# Altium project RP2040Breakout.PrjPcb (part 1 of 2)
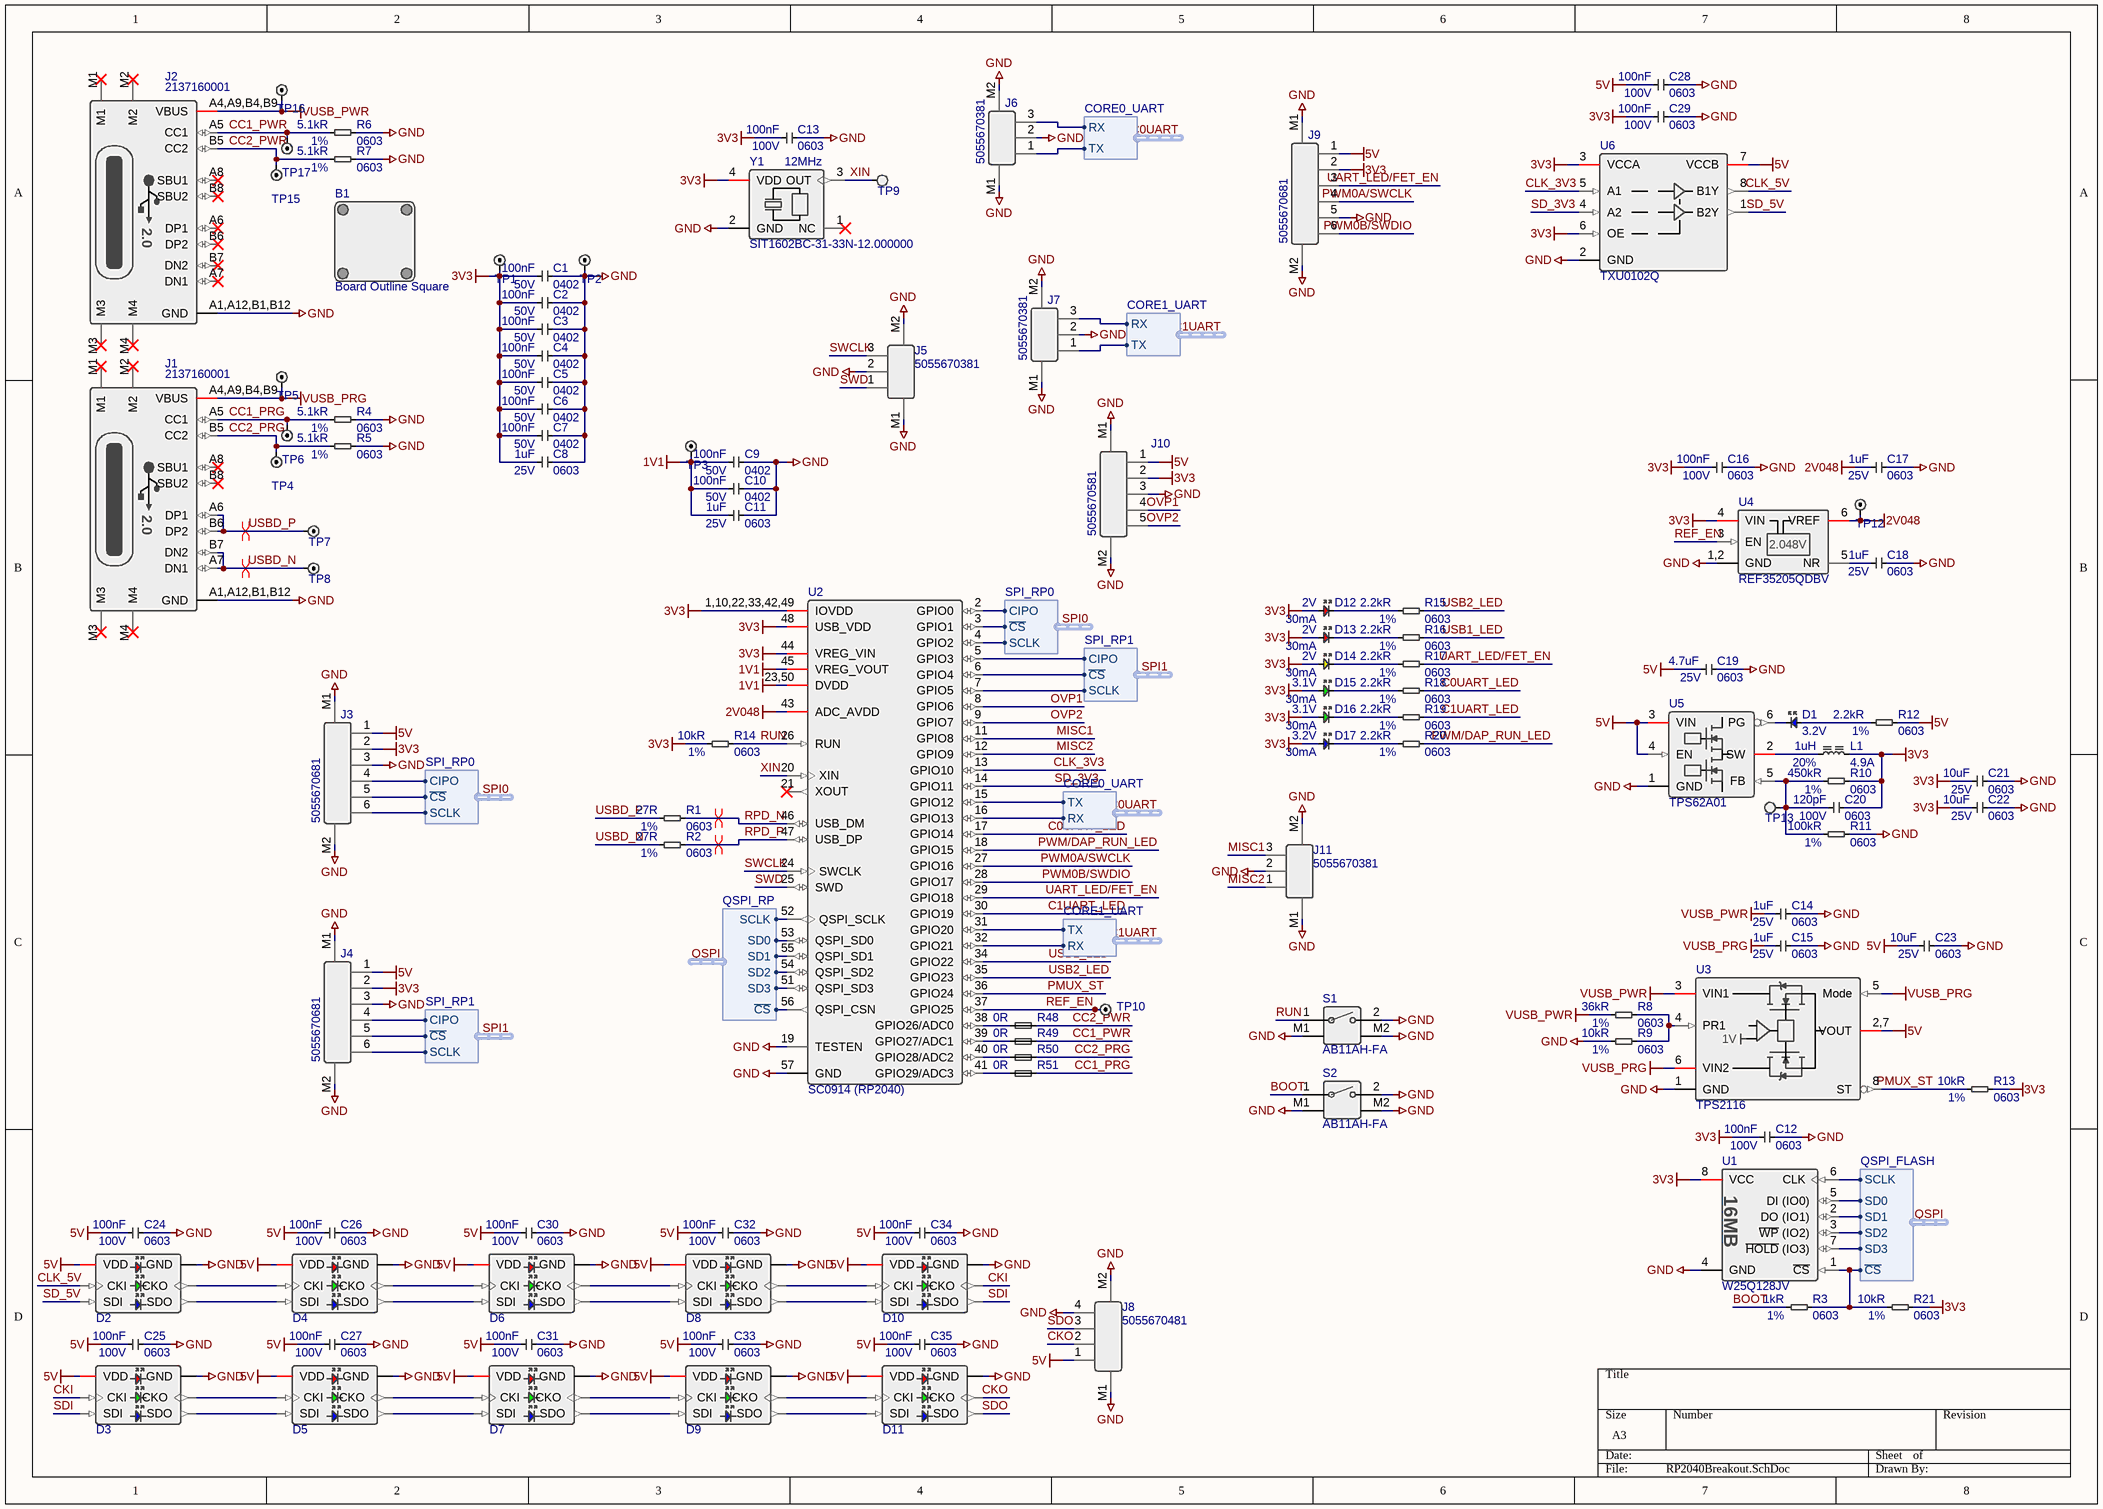
[diagram p0: RP2040Breakout.SchDoc]
2 sheets, 125 parts. Net scope: global (net labels, ports and power ports of the same name join across sheets).
Board file: RP2040Breakout.PcbDoc
Sheets:
  RP2040Breakout.SchDoc
  USBPowerMux.SchDoc

## Sheet RP2040Breakout.SchDoc
size A3; SheetNumber: 1; SheetTotal: 2

### Parts
(Parts that share a designator on the sheet are numbered #1, #2 ... from top to bottom, then left to right.)
B1  Board Outline Square  [PCB_OUTLINE_SQUARE]
C1#1  value 100nF  Voltage - Rated: 50V  Package/Case Imperial: 0402  [CAPACITOR_0402(1005)_GENERIC]  (hidden comment: Capacitor - Ceramic - Generic)
C2#1  value 100nF  Voltage - Rated: 50V  Package/Case Imperial: 0402  [CAPACITOR_0402(1005)_GENERIC]  (hidden comment: Capacitor - Ceramic - Generic)
C3#1  value 100nF  Voltage - Rated: 50V  Package/Case Imperial: 0402  [CAPACITOR_0402(1005)_GENERIC]  (hidden comment: Capacitor - Ceramic - Generic)
C4  value 100nF  Voltage - Rated: 50V  Package/Case Imperial: 0402  [CAPACITOR_0402(1005)_GENERIC]  (hidden comment: Capacitor - Ceramic - Generic)
C5  value 100nF  Voltage - Rated: 50V  Package/Case Imperial: 0402  [CAPACITOR_0402(1005)_GENERIC]  (hidden comment: Capacitor - Ceramic - Generic)
C6  value 100nF  Voltage - Rated: 50V  Package/Case Imperial: 0402  [CAPACITOR_0402(1005)_GENERIC]  (hidden comment: Capacitor - Ceramic - Generic)
C7  value 100nF  Voltage - Rated: 50V  Package/Case Imperial: 0402  [CAPACITOR_0402(1005)_GENERIC]  (hidden comment: Capacitor - Ceramic - Generic)
C8  value 1uF  Voltage - Rated: 25V  Package/Case Imperial: 0603  [CAPACITOR_0603(1608)_GENERIC]  (hidden comment: Capacitor - Ceramic - Generic)
C9  value 100nF  Voltage - Rated: 50V  Package/Case Imperial: 0402  [CAPACITOR_0402(1005)_GENERIC]  (hidden comment: Capacitor - Ceramic - Generic)
C10  value 100nF  Voltage - Rated: 50V  Package/Case Imperial: 0402  [CAPACITOR_0402(1005)_GENERIC]  (hidden comment: Capacitor - Ceramic - Generic)
C11  value 1uF  Voltage - Rated: 25V  Package/Case Imperial: 0603  [CAPACITOR_0603(1608)_GENERIC]  (hidden comment: Capacitor - Ceramic - Generic)
C12  value 100nF  Voltage - Rated: 100V  Package/Case Imperial: 0603  [CAPACITOR_0603(1608)_GENERIC]  (hidden comment: Capacitor - Ceramic - Generic)
C13  value 100nF  Voltage - Rated: 100V  Package/Case Imperial: 0603  [CAPACITOR_0603(1608)_GENERIC]  (hidden comment: Capacitor - Ceramic - Generic)
C14  value 1uF  Voltage - Rated: 25V  Package/Case Imperial: 0603  [CAPACITOR_0603(1608)_GENERIC]  (hidden comment: Capacitor - Ceramic - Generic)
C15  value 1uF  Voltage - Rated: 25V  Package/Case Imperial: 0603  [CAPACITOR_0603(1608)_GENERIC]  (hidden comment: Capacitor - Ceramic - Generic)
C16  value 100nF  Voltage - Rated: 100V  Package/Case Imperial: 0603  [CAPACITOR_0603(1608)_GENERIC]  (hidden comment: Capacitor - Ceramic - Generic)
C17  value 1uF  Voltage - Rated: 25V  Package/Case Imperial: 0603  [CAPACITOR_0603(1608)_GENERIC]  (hidden comment: Capacitor - Ceramic - Generic)
C18  value 1uF  Voltage - Rated: 25V  Package/Case Imperial: 0603  [CAPACITOR_0603(1608)_GENERIC]  (hidden comment: Capacitor - Ceramic - Generic)
C19  value 4.7uF  Voltage - Rated: 25V  Package/Case Imperial: 0603  [CAPACITOR_0603(1608)_GENERIC]  (hidden comment: Capacitor - Ceramic - Generic)
C20  value 120pF  Voltage - Rated: 100V  Package/Case Imperial: 0603  [CAPACITOR_0603(1608)_GENERIC]  (hidden comment: Capacitor - Ceramic - Generic)
C21  value 10uF  Voltage - Rated: 25V  Package/Case Imperial: 0603  [CAPACITOR_0603(1608)_GENERIC]  (hidden comment: Capacitor - Ceramic - Generic)
C22  value 10uF  Voltage - Rated: 25V  Package/Case Imperial: 0603  [CAPACITOR_0603(1608)_GENERIC]  (hidden comment: Capacitor - Ceramic - Generic)
C23  value 10uF  Voltage - Rated: 25V  Package/Case Imperial: 0603  [CAPACITOR_0603(1608)_GENERIC]  (hidden comment: Capacitor - Ceramic - Generic)
C24  value 100nF  Voltage - Rated: 100V  Package/Case Imperial: 0603  [CAPACITOR_0603(1608)_GENERIC]  (hidden comment: Capacitor - Ceramic - Generic)
C25  value 100nF  Voltage - Rated: 100V  Package/Case Imperial: 0603  [CAPACITOR_0603(1608)_GENERIC]  (hidden comment: Capacitor - Ceramic - Generic)
C26  value 100nF  Voltage - Rated: 100V  Package/Case Imperial: 0603  [CAPACITOR_0603(1608)_GENERIC]  (hidden comment: Capacitor - Ceramic - Generic)
C27  value 100nF  Voltage - Rated: 100V  Package/Case Imperial: 0603  [CAPACITOR_0603(1608)_GENERIC]  (hidden comment: Capacitor - Ceramic - Generic)
C28  value 100nF  Voltage - Rated: 100V  Package/Case Imperial: 0603  [CAPACITOR_0603(1608)_GENERIC]  (hidden comment: Capacitor - Ceramic - Generic)
C29  value 100nF  Voltage - Rated: 100V  Package/Case Imperial: 0603  [CAPACITOR_0603(1608)_GENERIC]  (hidden comment: Capacitor - Ceramic - Generic)
C30  value 100nF  Voltage - Rated: 100V  Package/Case Imperial: 0603  [CAPACITOR_0603(1608)_GENERIC]  (hidden comment: Capacitor - Ceramic - Generic)
C31  value 100nF  Voltage - Rated: 100V  Package/Case Imperial: 0603  [CAPACITOR_0603(1608)_GENERIC]  (hidden comment: Capacitor - Ceramic - Generic)
C32  value 100nF  Voltage - Rated: 100V  Package/Case Imperial: 0603  [CAPACITOR_0603(1608)_GENERIC]  (hidden comment: Capacitor - Ceramic - Generic)
C33  value 100nF  Voltage - Rated: 100V  Package/Case Imperial: 0603  [CAPACITOR_0603(1608)_GENERIC]  (hidden comment: Capacitor - Ceramic - Generic)
C34  value 100nF  Voltage - Rated: 100V  Package/Case Imperial: 0603  [CAPACITOR_0603(1608)_GENERIC]  (hidden comment: Capacitor - Ceramic - Generic)
C35  value 100nF  Voltage - Rated: 100V  Package/Case Imperial: 0603  [CAPACITOR_0603(1608)_GENERIC]  (hidden comment: Capacitor - Ceramic - Generic)
D1  Forward Voltage: 3.2V  [WL-SMSW_3014_WURTH]  (hidden comment: 155301BS73100)
D2  APA102C  [5X5MM(6PIN)_JLEAD_GENERIC]  (value not drawn)
D3  APA102C  [5X5MM(6PIN)_JLEAD_GENERIC]  (value not drawn)
D4  APA102C  [5X5MM(6PIN)_JLEAD_GENERIC]  (value not drawn)
D5  APA102C  [5X5MM(6PIN)_JLEAD_GENERIC]  (value not drawn)
D6  APA102C  [5X5MM(6PIN)_JLEAD_GENERIC]  (value not drawn)
D7  APA102C  [5X5MM(6PIN)_JLEAD_GENERIC]  (value not drawn)
D8  APA102C  [5X5MM(6PIN)_JLEAD_GENERIC]  (value not drawn)
D9  APA102C  [5X5MM(6PIN)_JLEAD_GENERIC]  (value not drawn)
D10  APA102C  [5X5MM(6PIN)_JLEAD_GENERIC]  (value not drawn)
D11  APA102C  [5X5MM(6PIN)_JLEAD_GENERIC]  (value not drawn)
D12  Current - Max: 30mA  Forward Voltage: 2V  [WL-SMSW_3014_WURTH]  (hidden comment: 155301RS73100)
D13  Current - Max: 30mA  Forward Voltage: 2V  [WL-SMSW_3014_WURTH]  (hidden comment: 155301RS73100)
D14  Current - Max: 30mA  Forward Voltage: 2V  [WL-SMSW_3014_WURTH]  (hidden comment: 155301YS73100)
D15  Current - Max: 30mA  Forward Voltage: 3.1V  [WL-SMSW_3014_WURTH]  (hidden comment: 155301GS73100)
D16  Current - Max: 30mA  Forward Voltage: 3.1V  [WL-SMSW_3014_WURTH]  (hidden comment: 155301GS73100)
D17  Current - Max: 30mA  Forward Voltage: 3.2V  [WL-SMSW_3014_WURTH]  (hidden comment: 155301BS73100)
J1  2137160001  [CONN_PORT_USB-C_MOLEX-2137160001]
J2  2137160001  [CONN_PORT_USB-C_MOLEX-2137160001]
J3  Manufacturer Part Number 1: 5055670681  [CONNECTOR_HEADER_MOLEX_5055670681]  (hidden comment: Connector - Header - 6P 2M - Generic)
J4  Manufacturer Part Number 1: 5055670681  [CONNECTOR_HEADER_MOLEX_5055670681]  (hidden comment: Connector - Header - 6P 2M - Generic)
J5  Manufacturer Part Number 1: 5055670381  [CONNECTOR_HEADER_MOLEX_5055670381]  (hidden comment: Connector - Header - 3P 2M - Generic)
J6  Manufacturer Part Number 1: 5055670381  [CONNECTOR_HEADER_MOLEX_5055670381]  (hidden comment: Connector - Header - 3P 2M - Generic)
J7  Manufacturer Part Number 1: 5055670381  [CONNECTOR_HEADER_MOLEX_5055670381]  (hidden comment: Connector - Header - 3P 2M - Generic)
J8  Manufacturer Part Number 1: 5055670481  [CONNECTOR_HEADER_MOLEX_5055670481]  (hidden comment: Connector - Header - 4P 2M - Generic)
J9  Manufacturer Part Number 1: 5055670681  [CONNECTOR_HEADER_MOLEX_5055670681]  (hidden comment: Connector - Header - 6P 2M - Generic)
J10  Manufacturer Part Number 1: 5055670581  [CONNECTOR_HEADER_MOLEX_5055670581]  (hidden comment: Connector - Header - 5P 2M - Generic)
J11  Manufacturer Part Number 1: 5055670381  [CONNECTOR_HEADER_MOLEX_5055670381]  (hidden comment: Connector - Header - 3P 2M - Generic)
L1  value 1uH  Tolerance: 20%  Current - Rating: 4.9A  [XGL3512_COILCRAFT]  (hidden comment: Inductor - Ferrite Core - Generic)
R1#1  value 27R  Tolerance: 1%  Package/Case Imperial: 0603  [RESISTOR_0603(1608)_GENERIC]  (hidden comment: Resistor - Fixed - Generic)
R2#1  value 27R  Tolerance: 1%  Package/Case Imperial: 0603  [RESISTOR_0603(1608)_GENERIC]  (hidden comment: Resistor - Fixed - Generic)
R3#1  value 1kR  Tolerance: 1%  Package/Case Imperial: 0603  [RESISTOR_0603(1608)_GENERIC]  (hidden comment: Resistor - Fixed - Generic)
R4#1  value 5.1kR  Tolerance: 1%  Package/Case Imperial: 0603  [RESISTOR_0603(1608)_GENERIC]  (hidden comment: Resistor - Fixed - Generic)
R5  value 5.1kR  Tolerance: 1%  Package/Case Imperial: 0603  [RESISTOR_0603(1608)_GENERIC]  (hidden comment: Resistor - Fixed - Generic)
R6  value 5.1kR  Tolerance: 1%  Package/Case Imperial: 0603  [RESISTOR_0603(1608)_GENERIC]  (hidden comment: Resistor - Fixed - Generic)
R7  value 5.1kR  Tolerance: 1%  Package/Case Imperial: 0603  [RESISTOR_0603(1608)_GENERIC]  (hidden comment: Resistor - Fixed - Generic)
R8  value 36kR  Tolerance: 1%  Package/Case Imperial: 0603  [RESISTOR_0603(1608)_GENERIC]  (hidden comment: Resistor - Fixed - Generic)
R9  value 10kR  Tolerance: 1%  Package/Case Imperial: 0603  [RESISTOR_0603(1608)_GENERIC]  (hidden comment: Resistor - Fixed - Generic)
R10  value 450kR  Tolerance: 1%  Package/Case Imperial: 0603  [RESISTOR_0603(1608)_GENERIC]  (hidden comment: Resistor - Fixed - Generic)
R11  value 100kR  Tolerance: 1%  Package/Case Imperial: 0603  [RESISTOR_0603(1608)_GENERIC]  (hidden comment: Resistor - Fixed - Generic)
R12  value 2.2kR  Tolerance: 1%  Package/Case Imperial: 0603  [RESISTOR_0603(1608)_GENERIC]  (hidden comment: Resistor - Fixed - Generic)
R13  value 10kR  Tolerance: 1%  Package/Case Imperial: 0603  [RESISTOR_0603(1608)_GENERIC]  (hidden comment: Resistor - Fixed - Generic)
R14  value 10kR  Tolerance: 1%  Package/Case Imperial: 0603  [RESISTOR_0603(1608)_GENERIC]  (hidden comment: Resistor - Fixed - Generic)
R15  value 2.2kR  Tolerance: 1%  Package/Case Imperial: 0603  [RESISTOR_0603(1608)_GENERIC]  (hidden comment: Resistor - Fixed - Generic)
R16  value 2.2kR  Tolerance: 1%  Package/Case Imperial: 0603  [RESISTOR_0603(1608)_GENERIC]  (hidden comment: Resistor - Fixed - Generic)
R17  value 2.2kR  Tolerance: 1%  Package/Case Imperial: 0603  [RESISTOR_0603(1608)_GENERIC]  (hidden comment: Resistor - Fixed - Generic)
R18  value 2.2kR  Tolerance: 1%  Package/Case Imperial: 0603  [RESISTOR_0603(1608)_GENERIC]  (hidden comment: Resistor - Fixed - Generic)
R19  value 2.2kR  Tolerance: 1%  Package/Case Imperial: 0603  [RESISTOR_0603(1608)_GENERIC]  (hidden comment: Resistor - Fixed - Generic)
R20  value 2.2kR  Tolerance: 1%  Package/Case Imperial: 0603  [RESISTOR_0603(1608)_GENERIC]  (hidden comment: Resistor - Fixed - Generic)
R21  value 10kR  Tolerance: 1%  Package/Case Imperial: 0603  [RESISTOR_0603(1608)_GENERIC]  (hidden comment: Resistor - Fixed - Generic)
R48  value 0R  [RESISTOR_0603(1608)_NC_JUMPER]  (hidden comment: Resistor - Fixed - Jumper)  (net tie, no BOM)
R49  value 0R  [RESISTOR_0603(1608)_NC_JUMPER]  (hidden comment: Resistor - Fixed - Jumper)  (net tie, no BOM)
R50  value 0R  [RESISTOR_0603(1608)_NC_JUMPER]  (hidden comment: Resistor - Fixed - Jumper)  (net tie, no BOM)
R51  value 0R  [RESISTOR_0603(1608)_NC_JUMPER]  (hidden comment: Resistor - Fixed - Jumper)  (net tie, no BOM)
S1  AB11AH-FA  [SWITCH_PUSHBUTTON_NKK_AB11AH-FA]
S2  AB11AH-FA  [SWITCH_PUSHBUTTON_NKK_AB11AH-FA]
TP1  Test Point - THT  [TESTPOINT_THT_OCTAGON]  (value not drawn)
TP2  Test Point - THT  [TESTPOINT_THT_OCTAGON]  (value not drawn)
TP3  Test Point - THT  [TESTPOINT_THT_OCTAGON]  (value not drawn)
TP4  Test Point - THT  [TESTPOINT_THT_OCTAGON]  (value not drawn)
TP5  Test Point - THT  [TESTPOINT_THT_OCTAGON]  (value not drawn)
TP6  Test Point - THT  [TESTPOINT_THT_OCTAGON]  (value not drawn)
TP7  Test Point - THT  [TESTPOINT_THT_OCTAGON]  (value not drawn)
TP8  Test Point - THT  [TESTPOINT_THT_OCTAGON]  (value not drawn)
TP9  Test Point - SMT  [TESTPOINT_SMT_OCTAGON]  (value not drawn)
TP10  Test Point - THT  [TESTPOINT_THT_OCTAGON]  (value not drawn)
TP12  Test Point - THT  [TESTPOINT_THT_OCTAGON]  (value not drawn)
TP13  Test Point - SMT  [TESTPOINT_SMT_OCTAGON]  (value not drawn)
TP15  Test Point - THT  [TESTPOINT_THT_OCTAGON]  (value not drawn)
TP16  Test Point - THT  [TESTPOINT_THT_OCTAGON]  (value not drawn)
TP17  Test Point - THT  [TESTPOINT_THT_OCTAGON]  (value not drawn)
U1#1  W25Q128JV  [WSON-8(6x5mm)_WINBOND]
U2  SC0914 (RP2040)  [QFN-56(7x7)_RASPBERRYPI]
U3  TPS2116  [SOT-583(DRL0008A)_TI]
U4  REF35205QDBV  [SOT23-6(DBV0006A)_TI]
U5  TPS62A01  [SOT-563(DRL0006A)_TI]
U6  TXU0102Q  [VSSOP-8(DCU0008A)_TI]
Y1  SIT1602BC-31-33N-12.000000  Frequency: 12MHz  [4-SMD(4-QFN)_SiTime]

### Harnesses
QSPI_RP: SCLK, SD0, SD1, SD2, SD3, ~{CS}
QSPI_FLASH: SCLK, ~{CS}, SD0, SD1, SD2, SD3
CORE0_UART: TX, RX
CORE1_UART: TX, RX
SPI_RP0: SCLK, CIPO, ~{CS}
SPI_RP1: SCLK, CIPO, ~{CS}

### Nets
1V1: C9.2 C10.2 C11.2 TP3.1 U2.23,50(DVDD) U2.45(VREG_VOUT)
2V048: C17.2 TP12.1 U2.43(ADC_AVDD) U4.6(VREF)
3V3: C1#1.2 C2#1.2 C3#1.2 C4.2 C5.2 C6.2 C7.2 C8.2 C12.1 C13.1 C16.1 C20.2 C21.2 C22.2 C29.1 D12.2(A) D13.2(A) D14.2(A) D15.2(A) D16.2(A) D17.2(A) J3.2 J4.2 J9.2 J10.2 L1.2 R10.1 R13.2 R14.1 R21.2 TP1.1 U1#1.8(VCC) U2.1,10,22,33,42,49(IOVDD) U2.44(VREG_VIN) U2.48(USB_VDD) U4.4(VIN) U6.3(VCCA) U6.6(OE) Y1.4(VDD)
5V: C19.1 C23.2 C24.1 C25.1 C26.1 C27.1 C28.1 C30.1 C31.1 C32.1 C33.1 C34.1 C35.1 D2.4(VDD) D3.4(VDD) D4.4(VDD) D5.4(VDD) D6.4(VDD) D7.4(VDD) D8.4(VDD) D9.4(VDD) D10.4(VDD) D11.4(VDD) J3.1 J4.1 J8.1 J9.1 J10.1 R12.2 U3.2,7(VOUT) U5.3(VIN) U5.4(EN) U6.7(VCCB)
GND: C1#1.1 C2#1.1 C3#1.1 C4.1 C5.1 C6.1 C7.1 C8.1 C9.1 C10.1 C11.1 C12.2 C13.2 C14.1 C15.1 C16.2 C17.1 C18.1 C19.2 C21.1 C22.1 C23.1 C24.2 C25.2 C26.2 C27.2 C28.2 C29.2 C30.2 C31.2 C32.2 C33.2 C34.2 C35.2 D2.3(GND) D3.3(GND) D4.3(GND) D5.3(GND) D6.3(GND) D7.3(GND) D8.3(GND) D9.3(GND) D10.3(GND) D11.3(GND) J1.A1,A12,B1,B12(GND) J2.A1,A12,B1,B12(GND) J3.3 J3.M1 J3.M2 J4.3 J4.M1 J4.M2 J5.2 J5.M1 J5.M2 J6.2 J6.M1 J6.M2 J7.2 J7.M1 J7.M2 J8.4 J8.M1 J8.M2 J9.5 J9.M1 J9.M2 J10.3 J10.M1 J10.M2 J11.2 J11.M1 J11.M2 R4#1.2 R5.2 R6.2 R7.2 R9.1 R11.2 S1.2 S1.M1 S1.M2 S2.2 S2.M1 S2.M2 TP2.1 U1#1.4(GND) U2.19(TESTEN) U2.57(GND) U3.1(GND) U4.1,2(GND) U5.1(GND) U6.2(GND) Y1.2(GND)
VUSB_PRG: C15.2 J1.A4,A9,B4,B9(VBUS) TP5.1 U3.5(Mode) U3.6(VIN2)
VUSB_PWR: C14.2 J2.A4,A9,B4,B9(VBUS) R8.1 TP16.1 U3.3(VIN1)
BOOT: R3#1.1 S2.1
C0UART.RX: J6.3 U2.16(GPIO13) ; harness CORE0_UART.RX
C0UART.TX: J6.1 U2.15(GPIO12) ; harness CORE0_UART.TX
C0UART_LED: R18.2 U2.17(GPIO14)
C1UART.RX: J7.3 U2.32(GPIO21) ; harness CORE1_UART.RX
C1UART.TX: J7.1 U2.31(GPIO20) ; harness CORE1_UART.TX
C1UART_LED: R19.2 U2.30(GPIO19)
CC1_PRG: J1.A5(CC1) R4#1.1 R51.2 TP6.1
CC1_PWR: J2.A5(CC1) R6.1 R49.2 TP17.1
CC2_PRG: J1.B5(CC2) R5.1 R50.2 TP4.1
CC2_PWR: J2.B5(CC2) R7.1 R48.2 TP15.1
CKI: D3.2(CKI) D10.5(CKO)
CKO: D11.5(CKO) J8.2
CLK_3V3: U2.13(GPIO10) U6.5(A1)
CLK_5V: D2.2(CKI) U6.8(B1Y)
MISC1: J11.3 U2.11(GPIO8)
MISC2: J11.1 U2.12(GPIO9)
OVP1: J10.4 U2.8(GPIO6)
OVP2: J10.5 U2.9(GPIO7)
PMUX_ST: R13.1 U2.36(GPIO24) U3.8(ST)
PWM0A/SWCLK: J9.4 U2.27(GPIO16)
PWM0B/SWDIO: J9.6 U2.28(GPIO17)
PWM/DAP_RUN_LED: R20.2 U2.18(GPIO15)
QSPI.~{CS}: R3#1.2 R21.1 U1#1.1(~{CS}) U2.56(QSPI_CSN) ; harness QSPI_RP.~{CS}, harness QSPI_FLASH.~{CS}
QSPI.SCLK: U1#1.6(CLK) U2.52(QSPI_SCLK) ; harness QSPI_RP.SCLK, harness QSPI_FLASH.SCLK
QSPI.SD0: U1#1.5(DI_(IO0)) U2.53(QSPI_SD0) ; harness QSPI_RP.SD0, harness QSPI_FLASH.SD0
QSPI.SD1: U1#1.2(DO_(IO1)) U2.55(QSPI_SD1) ; harness QSPI_RP.SD1, harness QSPI_FLASH.SD1
QSPI.SD2: U1#1.3(~{WP}_(IO2)) U2.54(QSPI_SD2) ; harness QSPI_RP.SD2, harness QSPI_FLASH.SD2
QSPI.SD3: U1#1.7(~{HOLD}_(IO3)) U2.51(QSPI_SD3) ; harness QSPI_RP.SD3, harness QSPI_FLASH.SD3
REF_EN: TP10.1 U2.37(GPIO25) U4.3(EN)
RPD_N: R1#1.2 U2.46(USB_DM)
RPD_P: R2#1.2 U2.47(USB_DP)
RUN: R14.2 S1.1 U2.26(RUN)
SD_3V3: U2.14(GPIO11) U6.4(A2)
SD_5V: D2.1(SDI) U6.1(B2Y)
SDI: D3.1(SDI) D10.6(SDO)
SDO: D11.6(SDO) J8.3
SPI0.~{CS}: J3.5 U2.3(GPIO1) ; harness SPI_RP0.~{CS}
SPI0.CIPO: J3.4 U2.2(GPIO0) ; harness SPI_RP0.CIPO
SPI0.SCLK: J3.6 U2.4(GPIO2) ; harness SPI_RP0.SCLK
SPI1.~{CS}: J4.5 U2.6(GPIO4) ; harness SPI_RP1.~{CS}
SPI1.CIPO: J4.4 U2.5(GPIO3) ; harness SPI_RP1.CIPO
SPI1.SCLK: J4.6 U2.7(GPIO5) ; harness SPI_RP1.SCLK
SWCLK: J5.3 U2.24(SWCLK)
SWD: J5.1 U2.25(SWD)
UART_LED/FET_EN: J9.3 R17.2 U2.29(GPIO18)
USB1_LED: R16.2 U2.34(GPIO22)
USB2_LED: R15.2 U2.35(GPIO23)
USBD_N: J1.A7(DN1) J1.B7(DN2) R2#1.1 TP8.1
USBD_P: J1.A6(DP1) J1.B6(DP2) R1#1.1 TP7.1
XIN: TP9.1 U2.20(XIN) Y1.3(OUT)
NetC18_2: C18.2 U4.5(NR)
NetC20_1: C20.1 R10.2 R11.1 TP13.1 U5.5(FB)
NetD1_1: D1.1(C) U5.6(PG)
NetD1_2: D1.2(A) R12.1
NetD2_5: D2.5(CKO) D4.2(CKI)
NetD2_6: D2.6(SDO) D4.1(SDI)
NetD3_5: D3.5(CKO) D5.2(CKI)
NetD3_6: D3.6(SDO) D5.1(SDI)
NetD4_5: D4.5(CKO) D6.2(CKI)
NetD4_6: D4.6(SDO) D6.1(SDI)
NetD5_5: D5.5(CKO) D7.2(CKI)
NetD5_6: D5.6(SDO) D7.1(SDI)
NetD6_5: D6.5(CKO) D8.2(CKI)
NetD6_6: D6.6(SDO) D8.1(SDI)
NetD7_5: D7.5(CKO) D9.2(CKI)
NetD7_6: D7.6(SDO) D9.1(SDI)
NetD8_5: D8.5(CKO) D10.2(CKI)
NetD8_6: D8.6(SDO) D10.1(SDI)
NetD9_5: D9.5(CKO) D11.2(CKI)
NetD9_6: D9.6(SDO) D11.1(SDI)
NetD12_1: D12.1(C) R15.1
NetD13_1: D13.1(C) R16.1
NetD14_1: D14.1(C) R17.1
NetD15_1: D15.1(C) R18.1
NetD16_1: D16.1(C) R19.1
NetD17_1: D17.1(C) R20.1
NetL1_1: L1.1 U5.2(SW)
NetR8_2: R8.2 R9.2 U3.4(PR1)
NetR48_1: R48.1 U2.38(GPIO26/ADC0)
NetR49_1: R49.1 U2.39(GPIO27/ADC1)
NetR50_1: R50.1 U2.40(GPIO28/ADC2)
NetR51_1: R51.1 U2.41(GPIO29/ADC3)

Not connected (* = marked no-connect by the designer): J1 A8(SBU1)* B8(SBU2)* M1* M2* M3* M4*; J2 A6(DP1)* A7(DN1)* A8(SBU1)* B6(DP2)* B7(DN2)* B8(SBU2)* M1* M2* M3* M4*; U2 21(XOUT)*; Y1 1(NC)*

### Layout directives
differential pair: RPD_N, RPD_P, USBD_N, USBD_P

### Notes on the sheet
- (in symbol Connector - Ports - USB C - Molex 2137160001) 2.0
- (in symbol IC - Memory - Non-Volatile - WinBond W25Q128JV) 16MB
- (in symbol IC - Power Management - Mux - TI TPS2116) 1V
- (in symbol IC - Power Management - Voltage Reference - TI REF35205) 2.048V

### Library data of the parts
B1 = Board_Outline_Square
C1#1 C2#1 C3#1 C4-C7 C9 C10 = CAP-CER_100NF_50V_10%_X7R_0402(1005): 100nF ±10% 50V Ceramic Capacitor X7R 0402(1005 Metric); Manufacturer 1: Murata Electronics; Manufacturer Part Number 1: GRM155R71H104KE14J; Manufacturer Lifecycle 1: Active; Package/Case Metric: 1005; Name: CAP-CER_100NF_50V_10%_X7R_0402(1005); Item: CAP-CER; Temperature Coefficient: X7R; Tolerance: 10%; Mounting Type: SMT; Full Item: Ceramic Capacitor; Manufacturer 2: Murata Electronics; Manufacturer Part Number 2: GRM155C71H104KE19D; Manufacturer Lifecycle 2: Active; Manufacturer 3: Murata Electronics; Manufacturer Part Number 3: GRM155R71H104KE14D; Manufacturer Lifecycle 3: Active
C8 C11 C14 C15 C17 C18 = CAP-CER_1UF_25V_20%_X7R_0603(1608): 1uF ±20% 25V Ceramic Capacitor X7R 0603(1608 Metric); Manufacturer 1: Murata Electronics; Manufacturer Part Number 1: GCM188R71E105KA64D; Manufacturer Lifecycle 1: Active; Package/Case Metric: 1608; Name: CAP-CER_1UF_25V_20%_X7R_0603(1608); Item: CAP-CER; Temperature Coefficient: X7R; Tolerance: 20%; Mounting Type: SMT; Full Item: Ceramic Capacitor; Manufacturer 2: Murata Electronics; Manufacturer Part Number 2: GCM188R71E105KA64J; Manufacturer Lifecycle 2: Active; Manufacturer 3: Murata Electronics; Manufacturer Part Number 3: GCM188R71E105MA64D; Manufacturer Lifecycle 3: Active
C12 C13 C16 C24-C35 = CAP-CER_100NF_100V_20%_X7R_0603(1608): 100nF ±20% 100V Ceramic Capacitor X7R 0603(1608 Metric); Manufacturer 1: Murata Electronics; Manufacturer Part Number 1: GRM188R72A104KA35D; Manufacturer Lifecycle 1: Active; Package/Case Metric: 1608; Name: CAP-CER_100NF_100V_20%_X7R_0603(1608); Item: CAP-CER; Temperature Coefficient: X7R; Tolerance: 20%; Mounting Type: SMT; Full Item: Ceramic Capacitor; Manufacturer 2: Murata Electronics; Manufacturer Part Number 2: GRM188R72A104KA35J; Manufacturer Lifecycle 2: Active; Manufacturer 3: Murata Electronics; Manufacturer Part Number 3: GRM188R72A104MA35D; Manufacturer Lifecycle 3: Active
C19 = CAP-CER_4.7UF_25V_20%_X6S_0603(1608): 4.7uF ±20% 25V Ceramic Capacitor X6S 0603(1608 Metric); Manufacturer 1: Murata Electronics; Manufacturer Part Number 1: GRM188C81E475KE11D; Manufacturer Lifecycle 1: Active; Package/Case Metric: 1608; Name: CAP-CER_4.7UF_25V_20%_X6S_0603(1608); Item: CAP-CER; Temperature Coefficient: X6S; Tolerance: 20%; Mounting Type: SMT; Full Item: Ceramic Capacitor; Manufacturer 2: Murata Electronics; Manufacturer Part Number 2: GRM188C81E475ME11D; Manufacturer Lifecycle 2: Active; Manufacturer 3: Murata Electronics; Manufacturer Part Number 3: GRM188C81E475KE11J; Manufacturer Lifecycle 3: Active
C20 = CAP-CER_120PF_100V_5%_C0G/NP0_0603(1608): 120pF ±5% 100V Ceramic Capacitor C0G/NP0 0603(1608 Metric); Manufacturer 1: Murata Electronics; Manufacturer Part Number 1: GCM1885C2A121FA16D; Manufacturer Lifecycle 1: Active; Package/Case Metric: 1608; Name: CAP-CER_120PF_100V_5%_C0G/NP0_0603(1608); Item: CAP-CER; Temperature Coefficient: C0G/NP0; Tolerance: 5%; Mounting Type: SMT; Full Item: Ceramic Capacitor; Manufacturer 2: Murata Electronics; Manufacturer Part Number 2: GCM1885C2A121JA16D; Manufacturer Lifecycle 2: Active; Manufacturer 3: Murata Electronics; Manufacturer Part Number 3: GCM1885C2A121FA16J; Manufacturer Lifecycle 3: Active
C21-C23 = CAP-CER_10UF_25V_20%_X5R_0603(1608): 10uF ±20% 25V Ceramic Capacitor X5R 0603(1608 Metric); Manufacturer 1: Murata Electronics; Manufacturer Part Number 1: GRM188R61E106KA73J; Manufacturer Lifecycle 1: Active; Package/Case Metric: 1608; Name: CAP-CER_10UF_25V_20%_X5R_0603(1608); Item: CAP-CER; Temperature Coefficient: X5R; Tolerance: 20%; Mounting Type: SMT; Full Item: Ceramic Capacitor; Manufacturer 2: Murata Electronics; Manufacturer Part Number 2: GRM188R61E106MA73D; Manufacturer Lifecycle 2: Active; Manufacturer 3: Murata Electronics; Manufacturer Part Number 3: GRM188R61E106MA73J; Manufacturer Lifecycle 3: Active
D1 D17 = Diode - LED - Single LED - Wurth 155301BS73100
D2-D11 = Diode - LED - Addressable - 5x5mm APA102C: Supplier 1: Digi-Key; Supplier Part Number 1: 1568-COM-16345-ND; Supplier 2: Mouser; Supplier Part Number 2: 474-COM-16345
D12 D13 = Diode - LED - Single LED - Wurth 155301RS73100: Supplier 1: Digi-Key; Supplier Part Number 1: 732-155301RS73100CT-ND; Supplier 2: Digi-Key; Supplier Part Number 2: 732-155301RS73100DKR-ND; Supplier 3: Mouser; Supplier Part Number 3: 710-155301RS73100
D14 = Diode - LED - Single LED - Wurth 155301YS73100: Supplier 1: Digi-Key; Supplier Part Number 1: 732-155301YS73100CT-ND; Supplier 2: Digi-Key; Supplier Part Number 2: 732-155301YS73100DKR-ND; Supplier 3: Mouser; Supplier Part Number 3: 710-155301YS73100
D15 D16 = Diode - LED - Single LED - Wurth 155301GS73100: Supplier 1: Digi-Key; Supplier Part Number 1: 732-155301GS73100CT-ND; Supplier 2: Digi-Key; Supplier Part Number 2: 732-155301GS73100DKR-ND; Supplier 3: Mouser; Supplier Part Number 3: 710-155301GS73100
J1 J2 = Connector - Ports - USB C - Molex 2137160001: Supplier 1: Mouser; Supplier Part Number 1: 538-213716-0001; Supplier 2: Newark; Supplier Part Number 2: 13AJ2447; Supplier 3: Avnet; Supplier Part Number 3: 13AJ2447; Supplier 4: Farnell; Supplier Part Number 4: 3648629
J3 J4 J9 = CON_HDR_6P_1.25MM-PITCH_50V_2.4A_SMT_MOLEX_5055670681: Connector Header 6 Pin 1.25mm Pitch Mating 50V 2.4A Rated 8 Walls Shrouded SMT Molex 5055670681; Manufacturer Lifecycle 1: Active; Number of Positions: 6; Shrouding: 8 Walls; Name: CON_HDR_6P_1.25MM-PITCH_50V_2.4A_SMT_MOLEX_5055670681; Item: CON_HDR; Pitch - Mating: 1.25mm; Fastening Type: Locking Ramp; Voltage - Max: 50V; Current - Max: 2.4A; Mounting Type: SMT; Full Item: Connector Header; Manufacturer 1: Molex
J5-J7 J11 = CON_HDR_3P_1.25MM-PITCH_50V_2.4A_SMT_MOLEX_5055670381: Connector Header 3 Pin 1.25mm Pitch Mating 50V 2.4A Rated 5 Walls Shrouded SMT Molex 5055670381; Manufacturer Lifecycle 1: Active; Number of Positions: 3; Shrouding: 5 Walls; Name: CON_HDR_3P_1.25MM-PITCH_50V_2.4A_SMT_MOLEX_5055670381; Item: CON_HDR; Pitch - Mating: 1.25mm; Fastening Type: Locking Ramp; Voltage - Max: 50V; Current - Max: 2.4A; Mounting Type: SMT; Full Item: Connector Header; Manufacturer 1: Molex
J8 = CON_HDR_4P_1.25MM-PITCH_50V_2.4A_SMT_MOLEX_5055670481: Connector Header 4 Pin 1.25mm Pitch Mating 50V 2.4A Rated 6 Walls Shrouded SMT Molex 5055670481; Manufacturer Lifecycle 1: Active; Number of Positions: 4; Shrouding: 6 Walls; Name: CON_HDR_4P_1.25MM-PITCH_50V_2.4A_SMT_MOLEX_5055670481; Item: CON_HDR; Pitch - Mating: 1.25mm; Fastening Type: Locking Ramp; Voltage - Max: 50V; Current - Max: 2.4A; Mounting Type: SMT; Full Item: Connector Header; Manufacturer 1: Molex
J10 = CON_HDR_5P_1.25MM-PITCH_50V_2.4A_SMT_MOLEX_5055670581: Connector Header 5 Pin 1.25mm Pitch Mating 50V 2.4A Rated 7 Walls Shrouded SMT Molex 5055670581; Manufacturer Lifecycle 1: Active; Number of Positions: 5; Shrouding: 7 Walls; Name: CON_HDR_5P_1.25MM-PITCH_50V_2.4A_SMT_MOLEX_5055670581; Item: CON_HDR; Pitch - Mating: 1.25mm; Fastening Type: Locking Ramp; Voltage - Max: 50V; Current - Max: 2.4A; Mounting Type: SMT; Full Item: Connector Header; Manufacturer 1: Molex
L1 = IND-FXD_1UH_20%_32.2MR_4.5A_NONSTANDARD: Fixed Inductor 1uH 20% 32.2mR 4.9A Rated 4.5A Saturation Nonstandard 3.5mmx3.2mm; Manufacturer 1: Coilcraft; Manufacturer Part Number 1: XGL3512-102MEC; Manufacturer Lifecycle 1: Active; Type: Molded; Name: IND-FXD_1UH_20%_32.2MR_4.5A_NONSTANDARD; Item: IND-FXD; Package/Case Standard: Nonstandard; Package/Case Manufacturer: 3.5mmx3.2mm; DCR: 32.2mR; Current - Saturation: 4.5A; Mounting Type: SMT; Full Item: Fixed Inductor
R1#1 R2#1 = RES-FXD_27R_1%_100MW_100PPM/°C_0603(1608): 27R ±1% 100mW Chip Resistor 100ppm/°C 0603(1608 Metric); Manufacturer 1: Bourns Inc.; Manufacturer Part Number 1: CR0603-FX-27R0ELF; Manufacturer Lifecycle 1: Active; Package/Case Metric: 1608; Name: RES-FXD_27R_1%_100MW_100PPM/°C_0603(1608); Item: RES-FXD; Temperature Coefficient: 100ppm/°C; Power: 100mW; Mounting Type: SMT; Full Item: Chip Resistor; Manufacturer 2: Bourns Inc.; Manufacturer Part Number 2: CMP0603AFX-27R0ELF; Manufacturer Lifecycle 2: Active; Manufacturer 3: Bourns Inc.; Manufacturer Part Number 3: CMP0603-FX-27R0ELF; Manufacturer Lifecycle 3: Active
R3#1 = RES-FXD_1KR_1%_100MW_100PPM/°C_0603(1608): 1kR ±1% 100mW Chip Resistor 100ppm/°C 0603(1608 Metric); Manufacturer 1: Bourns Inc.; Manufacturer Part Number 1: CR0603-FX-1001ELF; Manufacturer Lifecycle 1: Active; Package/Case Metric: 1608; Name: RES-FXD_1KR_1%_100MW_100PPM/°C_0603(1608); Item: RES-FXD; Temperature Coefficient: 100ppm/°C; Power: 100mW; Mounting Type: SMT; Full Item: Chip Resistor; Manufacturer 2: Bourns Inc.; Manufacturer Part Number 2: CR0603AFX-1001ELF; Manufacturer Lifecycle 2: Active; Manufacturer 3: Bourns Inc.; Manufacturer Part Number 3: CRT0603-FY-1001ELF; Manufacturer Lifecycle 3: Active
R4#1 R5-R7 = RES-FXD_5.1KR_1%_100MW_100PPM/°C_0603(1608): 5.1kR ±1% 100mW Chip Resistor 100ppm/°C 0603(1608 Metric); Manufacturer 1: Bourns Inc.; Manufacturer Part Number 1: CR0603-FX-5101ELF; Manufacturer Lifecycle 1: Active; Package/Case Metric: 1608; Name: RES-FXD_5.1KR_1%_100MW_100PPM/°C_0603(1608); Item: RES-FXD; Temperature Coefficient: 100ppm/°C; Power: 100mW; Mounting Type: SMT; Full Item: Chip Resistor; Manufacturer 2: Bourns Inc.; Manufacturer Part Number 2: CR0603AFX-5101EAS; Manufacturer Lifecycle 2: Active
R8 = RES-FXD_36KR_1%_100MW_100PPM/°C_0603(1608): 36kR ±1% 100mW Chip Resistor 100ppm/°C 0603(1608 Metric); Manufacturer 1: Bourns Inc.; Manufacturer Part Number 1: CR0603-FX-3602ELF; Manufacturer Lifecycle 1: Active; Package/Case Metric: 1608; Name: RES-FXD_36KR_1%_100MW_100PPM/°C_0603(1608); Item: RES-FXD; Temperature Coefficient: 100ppm/°C; Power: 100mW; Mounting Type: SMT; Full Item: Chip Resistor
R9 R13 R14 R21 = RES-FXD_10KR_1%_100MW_100PPM/°C_0603(1608): 10kR ±1% 100mW Chip Resistor 100ppm/°C 0603(1608 Metric); Manufacturer 1: Bourns Inc.; Manufacturer Part Number 1: CR0603-FX-1002ELF; Manufacturer Lifecycle 1: Active; Package/Case Metric: 1608; Name: RES-FXD_10KR_1%_100MW_100PPM/°C_0603(1608); Item: RES-FXD; Temperature Coefficient: 100ppm/°C; Power: 100mW; Mounting Type: SMT; Full Item: Chip Resistor; Manufacturer 2: Bourns Inc.; Manufacturer Part Number 2: CR0603AFX-1002EAS; Manufacturer Lifecycle 2: Active; Manufacturer 3: Bourns Inc.; Manufacturer Part Number 3: CMP0603-FX-1002ELF; Manufacturer Lifecycle 3: Active
R10 = RES-FXD_450KR_1%_100MW_100PPM/°C_0603(1608): 450kR ±1% 100mW Chip Resistor 100ppm/°C 0603(1608 Metric); Manufacturer 1: Bourns Inc.; Manufacturer Part Number 1: CR0603-FX-4533ELF; Manufacturer Lifecycle 1: Active; Package/Case Metric: 1608; Name: RES-FXD_450KR_1%_100MW_100PPM/°C_0603(1608); Item: RES-FXD; Temperature Coefficient: 100ppm/°C; Power: 100mW; Mounting Type: SMT; Full Item: Chip Resistor
R11 = RES-FXD_100KR_1%_100MW_100PPM/°C_0603(1608): 100kR ±1% 100mW Chip Resistor 100ppm/°C 0603(1608 Metric); Manufacturer 1: Bourns Inc.; Manufacturer Part Number 1: CR0603-FX-1003ELF; Manufacturer Lifecycle 1: Active; Package/Case Metric: 1608; Name: RES-FXD_100KR_1%_100MW_100PPM/°C_0603(1608); Item: RES-FXD; Temperature Coefficient: 100ppm/°C; Power: 100mW; Mounting Type: SMT; Full Item: Chip Resistor; Manufacturer 2: Bourns Inc.; Manufacturer Part Number 2: CR0603AFX-1003EAS; Manufacturer Lifecycle 2: Active; Manufacturer 3: Bourns Inc.; Manufacturer Part Number 3: CMP0603AFX-1003ELF; Manufacturer Lifecycle 3: Active
R12 R15-R20 = RES-FXD_2.2KR_1%_100MW_100PPM/°C_0603(1608): 2.2kR ±1% 100mW Chip Resistor 100ppm/°C 0603(1608 Metric); Manufacturer 1: Bourns Inc.; Manufacturer Part Number 1: CR0603-FX-2201ELF; Manufacturer Lifecycle 1: Active; Package/Case Metric: 1608; Name: RES-FXD_2.2KR_1%_100MW_100PPM/°C_0603(1608); Item: RES-FXD; Temperature Coefficient: 100ppm/°C; Power: 100mW; Mounting Type: SMT; Full Item: Chip Resistor; Manufacturer 2: Bourns Inc.; Manufacturer Part Number 2: CMP0603QFX-2201ELF; Manufacturer Lifecycle 2: Active
R48-R51 = RES-JMP_0R_1%_100MW_100PPM/°C_0603(1608): 0R ±1% 100mW Chip Resistor with Jumper 100ppm/°C 0603(1608 Metric); Package/Case Imperial: 0603; Package/Case Metric: 1608; Tolerance: 1%; Name: RES-JMP_0R_1%_100MW_100PPM/°C_0603(1608); Item: RES-JMP; Temperature Coefficient: 100ppm/°C; Power: 100mW; Mounting Type: SMT; Full Item: Chip Resistor with Jumper
S1 S2 = Switch - Push Button - NKK AB11AH-FA: Supplier 1: Digi-Key; Supplier Part Number 1: 360-2744-ND; Supplier 2: Mouser; Supplier Part Number 2: 633-AB11AH-FA
U1#1 = IC - Memory - Non-Volatile - WinBond W25Q128JV: Supplier 1: Digi-Key; Supplier Part Number 1: W25Q128JVPIQ-ND; Supplier 2: Arrow Electronics; Supplier Part Number 2: W25Q128JVPIQ TR; Supplier 3: Digi-Key; Supplier Part Number 3: W25Q128JVPIQCT-ND; Supplier 4: Digi-Key; Supplier Part Number 4: W25Q128JVPIQDKR-ND
U2 = Integrated Circuit - Microcontroller - Raspberry Pi RP2040: Supplier 1: Digi-Key; Supplier Part Number 1: 2648-SC0914(7)CT-ND; Supplier 2: Digi-Key; Supplier Part Number 2: 2648-SC0914(7)DKR-ND; Supplier 3: Mouser; Supplier Part Number 3: 358-SC09147; Supplier 4: Digi-Key; Supplier Part Number 4: 2648-SC0914(13)CT-ND; Supplier 5: Digi-Key; Supplier Part Number 5: 2648-SC0914(13)DKR-ND; Supplier 6: Mouser; Supplier Part Number 6: 358-SC091413
U3 = IC - Power Management - Mux - TI TPS2116: Supplier 1: Mouser; Supplier Part Number 1: 595-TPS2116DRLR; Supplier 2: Texas Instruments; Supplier Part Number 2: TPS2116DRLR; Supplier 3: Digi-Key; Supplier Part Number 3: 296-TPS2116DRLRCT-ND; Supplier 4: Digi-Key; Supplier Part Number 4: 296-TPS2116DRLRDKR-ND
U4 = IC - Power Management - Voltage Reference - TI REF35205
U5 = IC - Power Management - DCDC SMPS - TI TPS62A01: Supplier 1: Mouser; Supplier Part Number 1: 595-TPS62A01DRLR; Supplier 2: Texas Instruments; Supplier Part Number 2: TPS62A01DRLR; Supplier 3: Digi-Key; Supplier Part Number 3: 296-TPS62A01DRLRCT-ND; Supplier 4: Digi-Key; Supplier Part Number 4: 296-TPS62A01DRLRDKR-ND
U6 = IC - Logic - Level Shifters - TI TXU0102: Supplier 1: Mouser; Supplier Part Number 1: 595-TXU0102QDCURQ1; Supplier 2: Texas Instruments; Supplier Part Number 2: TXU0102QDCURQ1; Supplier 3: Digi-Key; Supplier Part Number 3: 296-TXU0102QDCURQ1CT-ND; Supplier 4: Digi-Key; Supplier Part Number 4: 296-TXU0102QDCURQ1DKR-ND
Y1 = OSC_MEMS_12MHZ_20PPM_XO: 12 MHz XO (Standard) HCMOS, LVCMOS Oscillator 3.3V 4-SMD, No Lead; Package/Case Manufacturer: 4-QFN; Manufacturer 1: SiTime; Manufacturer Lifecycle 1: Active; Item: OSC; Resonator: MEMS; Frequency Stability: 20ppm; Input Voltage Min: 2.97V; Input Voltage Max: 3.63V; Min Temperature °C: -20; Max Temperature °C: 70; Supply Current: 4.5mA; Type: XO; Output: HCMOS, LVCMOS; Package/Case Standard: 4-SMD; Mounting Type: SMT; Full Item: Oscillator; Name: OSC_MEMS_12MHZ_20PPM_XO; Manufacturer Part Number 1: SIT1602BC-31-33N-12.000000